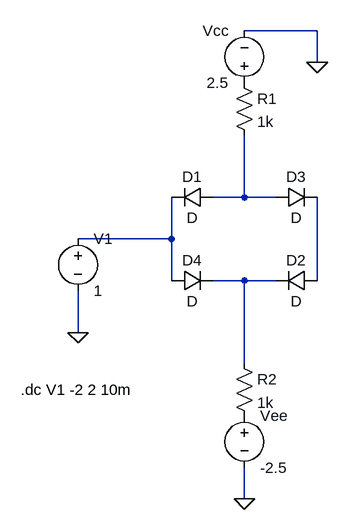
[diagram p0: schematic problem_353.asc]
problem_353.asc, the LTspice schematic file:
Version 4
SHEET 1 880 680
WIRE 320 -128 208 -128
WIRE 320 -80 320 -128
WIRE 208 128 208 32
WIRE 208 128 160 128
WIRE 256 128 208 128
WIRE 96 192 96 128
WIRE 96 192 -48 192
WIRE 96 256 96 192
WIRE 208 256 160 256
WIRE 256 256 208 256
WIRE 320 256 320 128
WIRE -48 336 -48 272
WIRE 208 384 208 256
WIRE 208 592 208 544
FLAG 320 -80 0
FLAG 208 592 0
FLAG -48 336 0
SYMBOL diode 160 112 R90
WINDOW 0 0 32 VBottom 2
WINDOW 3 32 32 VTop 2
SYMATTR InstName D1
SYMBOL diode 320 240 R90
WINDOW 0 0 32 VBottom 2
WINDOW 3 32 32 VTop 2
SYMATTR InstName D2
SYMBOL diode 256 144 R270
WINDOW 0 32 32 VTop 2
WINDOW 3 0 32 VBottom 2
SYMATTR InstName D3
SYMBOL diode 96 272 R270
WINDOW 0 32 32 VTop 2
WINDOW 3 0 32 VBottom 2
SYMATTR InstName D4
SYMBOL voltage -48 176 R0
WINDOW 123 0 0 Left 0
WINDOW 39 0 0 Left 0
SYMATTR InstName V1
SYMATTR Value 1
SYMBOL voltage 208 448 R0
WINDOW 123 0 0 Left 0
WINDOW 39 0 0 Left 0
SYMATTR InstName Vee
SYMATTR Value -2.5
SYMBOL voltage 208 -32 R180
WINDOW 0 24 96 Left 2
WINDOW 3 24 16 Left 2
WINDOW 123 0 0 Left 0
WINDOW 39 0 0 Left 0
SYMATTR InstName Vcc
SYMATTR Value 2.5
SYMBOL res 192 -64 R0
SYMATTR InstName R1
SYMATTR Value 1k
SYMBOL res 192 368 R0
SYMATTR InstName R2
SYMATTR Value 1k
TEXT -136 424 Left 2 !.dc V1 -2 2 10m

The netlist it stands for:
* problem_353.asc
D1 N001 N002 D
D2 N004 N003 D
D3 N001 N004 D
D4 N002 N003 D
V1 N002 0 1
Vee P001 0 -2.5
Vcc P002 0 2.5
R1 P002 N001 1k
R2 N003 P001 1k
.model D D
.lib standard.dio
.dc V1 -2 2 10m
.backanno
.end